# Altium schematic sheet RP2040.SchDoc
size Letter; SheetNumber: 2; SheetTotal: 2
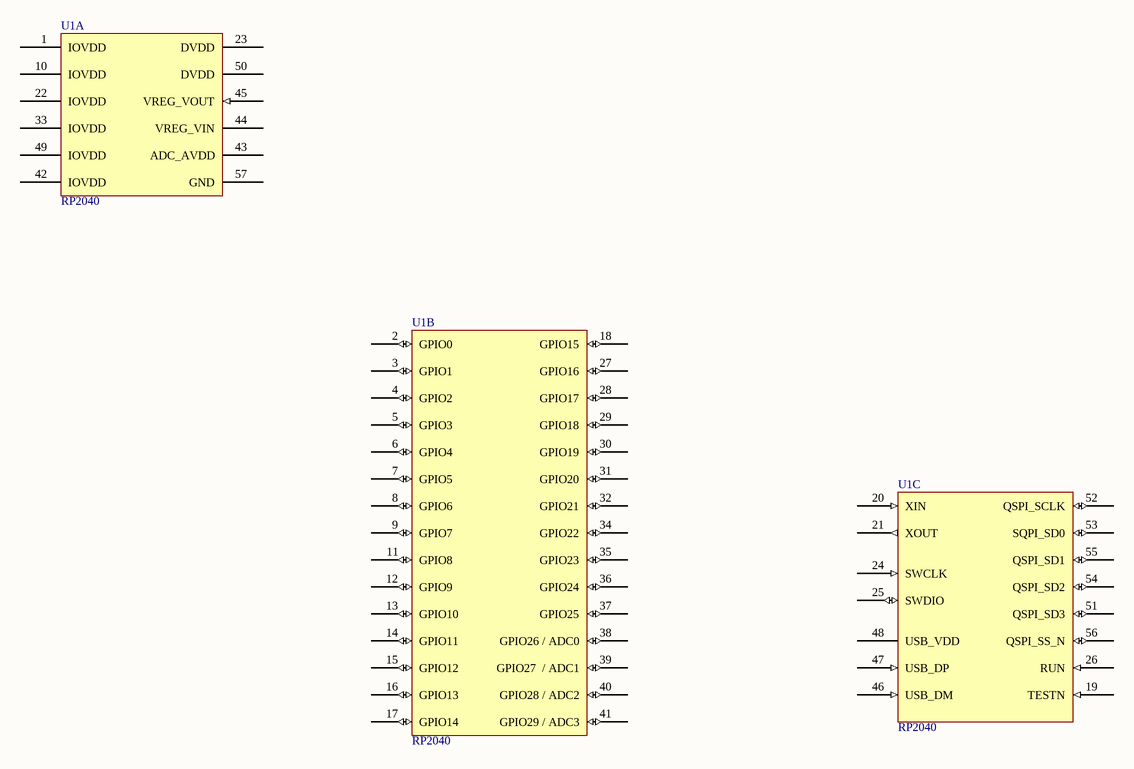
[diagram p0: RP2040.SchDoc]

## Parts
U1  RP2040  [QFN40P700X700X90_HS-57N]  (parts A,B,C of 3)

## Nets

Not connected (* = marked no-connect by the designer): U1 1(IOVDD) 2(GPIO0) 3(GPIO1) 4(GPIO2) 5(GPIO3) 6(GPIO4) 7(GPIO5) 8(GPIO6) 9(GPIO7) 10(IOVDD) 11(GPIO8) 12(GPIO9) 13(GPIO10) 14(GPIO11) 15(GPIO12) 16(GPIO13) 17(GPIO14) 18(GPIO15) 19(TESTN) 20(XIN) 21(XOUT) 22(IOVDD) 23(DVDD) 24(SWCLK) 25(SWDIO) 26(RUN) 27(GPIO16) 28(GPIO17) 29(GPIO18) 30(GPIO19) 31(GPIO20) 32(GPIO21) 33(IOVDD) 34(GPIO22) 35(GPIO23) 36(GPIO24) 37(GPIO25) 38(GPIO26_/_ADC0) 39(GPIO27__/_ADC1) 40(GPIO28_/_ADC2) 41(GPIO29_/_ADC3) 42(IOVDD) 43(ADC_AVDD) 44(VREG_VIN) 45(VREG_VOUT) 46(USB_DM) 47(USB_DP) 48(USB_VDD) 49(IOVDD) 50(DVDD) 51(QSPI_SD3) 52(QSPI_SCLK) 53(SQPI_SD0) 54(QSPI_SD2) 55(QSPI_SD1) 56(QSPI_SS_N) 57(GND)

## Notes on the sheet
- Project:
- Revision:
- Sheet
- of
- Schematic:
- Designer:
- Verified By:
- Liam Herlihy
- Date Published:
- Date Verified:
- Size:
- Letter

## Library data of the parts
U1 = RP2040: Supplier 1: Digi-Key; Supplier 2: Digi-Key; Supplier 3: Digi-Key; Supplier Part Number 1: 2648-SC0914(7)CT-ND; Supplier Part Number 3: 2648-SC0914(7)TR-ND; Supplier Part Number 2: 2648-SC0914(7)DKR-ND; ComponentLink1Description: Datasheet; ComponentLink1URL: file:///G:/Engineering%20work/Altium/Datasheets/mcu/rp2040-datasheet.pdf